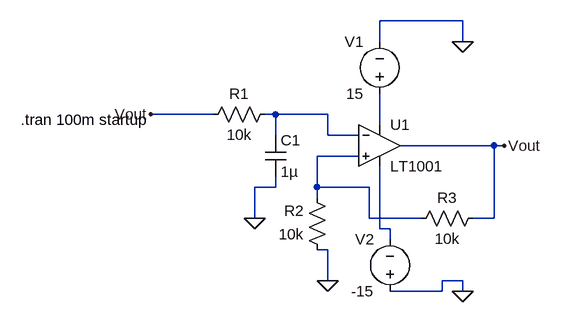
[diagram p0: schematic Relaxation oscillator 1.asc]
Relaxation oscillator 1.asc, the LTspice schematic file:
Version 4.1
SHEET 1 880 680
WIRE 416 -32 288 -32
WIRE 288 0 288 -32
WIRE 416 0 416 -32
WIRE 32 112 -64 112
WIRE 128 112 112 112
WIRE 208 112 128 112
WIRE 288 128 288 80
WIRE 128 144 128 112
WIRE 208 144 208 112
WIRE 256 144 208 144
WIRE 464 160 320 160
WIRE 480 160 464 160
WIRE 256 176 192 176
WIRE 128 224 128 208
WIRE 128 224 96 224
WIRE 192 224 192 176
WIRE 272 224 192 224
WIRE 192 240 192 224
WIRE 96 272 96 224
WIRE 272 272 272 224
WIRE 352 272 272 272
WIRE 464 272 464 160
WIRE 464 272 432 272
WIRE 288 288 288 192
WIRE 304 288 288 288
WIRE 304 304 304 288
WIRE 208 320 192 320
WIRE 208 368 208 320
WIRE 416 368 384 368
WIRE 384 384 384 368
WIRE 384 384 304 384
WIRE 416 384 416 368
FLAG 96 272 0
FLAG 208 368 0
FLAG 480 160 Vout
FLAG -64 112 Vout
FLAG 416 0 0
FLAG 416 384 0
SYMBOL OpAmps\\LT1001 288 96 R0
SYMATTR InstName U1
SYMBOL res 128 96 R90
WINDOW 0 0 56 VBottom 2
WINDOW 3 32 56 VTop 2
SYMATTR InstName R1
SYMATTR Value 10k
SYMBOL res 208 336 R180
WINDOW 0 36 76 Left 2
WINDOW 3 36 40 Left 2
SYMATTR InstName R2
SYMATTR Value 10k
SYMBOL res 336 288 R270
WINDOW 0 32 56 VTop 2
WINDOW 3 0 56 VBottom 2
SYMATTR InstName R3
SYMATTR Value 10k
SYMBOL cap 112 144 R0
SYMATTR InstName C1
SYMATTR Value 1µ
SYMBOL voltage 288 96 R180
WINDOW 0 24 96 Left 2
WINDOW 3 24 16 Left 2
SYMATTR InstName V1
SYMATTR Value 15
SYMBOL voltage 304 400 R180
WINDOW 0 24 96 Left 2
WINDOW 3 24 16 Left 2
SYMATTR InstName V2
SYMATTR Value -15
TEXT -264 120 Left 2 !.tran 100m startup

The netlist it stands for:
* Relaxation oscillator 1.asc
X§U1 N003 N001 N002 N004 Vout LT1001  ; pins In+ In- V+ V- OUT
R1 N001 Vout 10k
R2 0 N003 10k
R3 N003 Vout 10k
C1 N001 0 1µ
V1 N002 0 15
V2 0 N004 -15
.tran 100m startup
.lib LTC.lib
.backanno
.end